# Altium schematic sheet 28PinArduino.SchDoc (part 1 of 3)
size A2
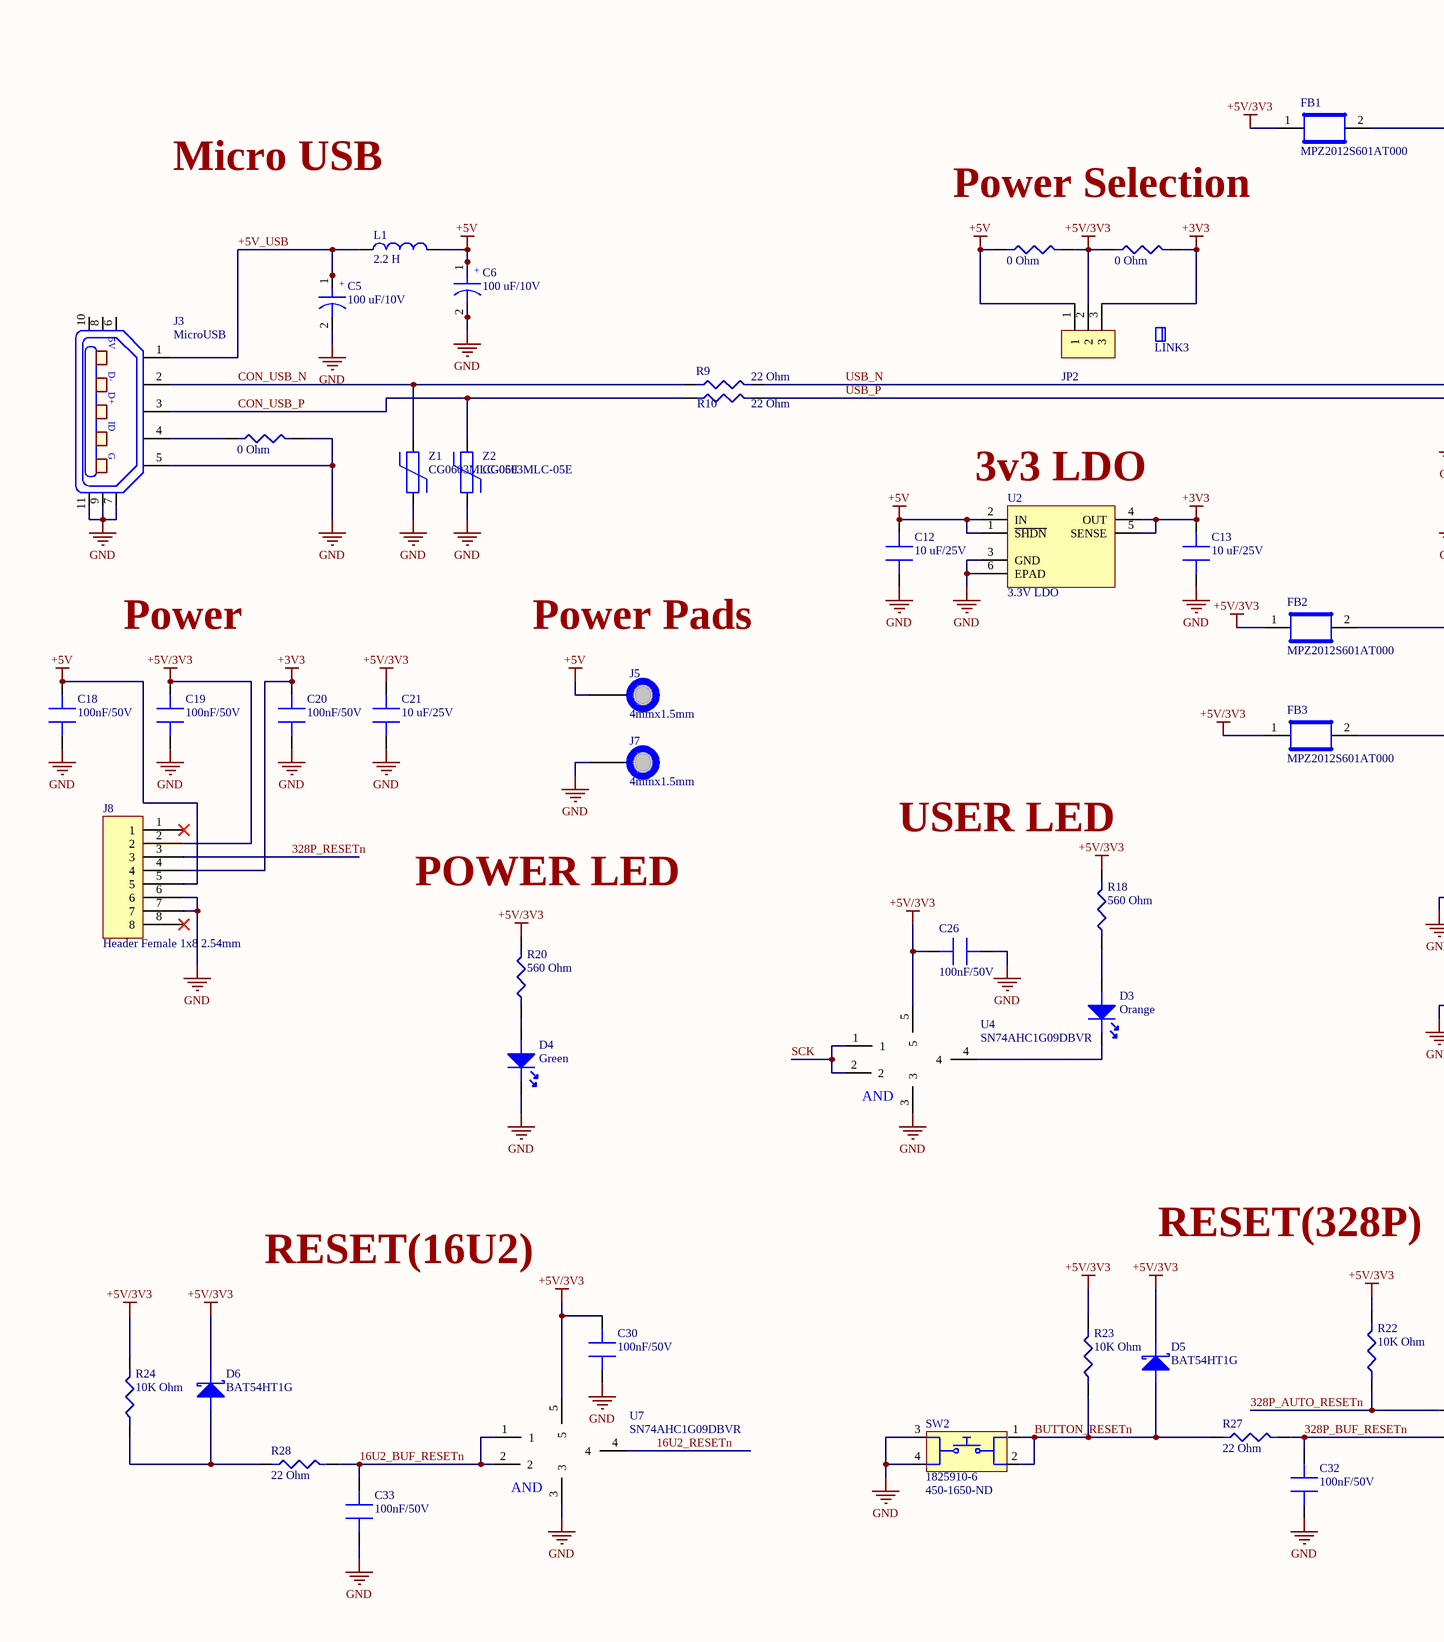
[diagram p0: 28PinArduino.SchDoc, left]
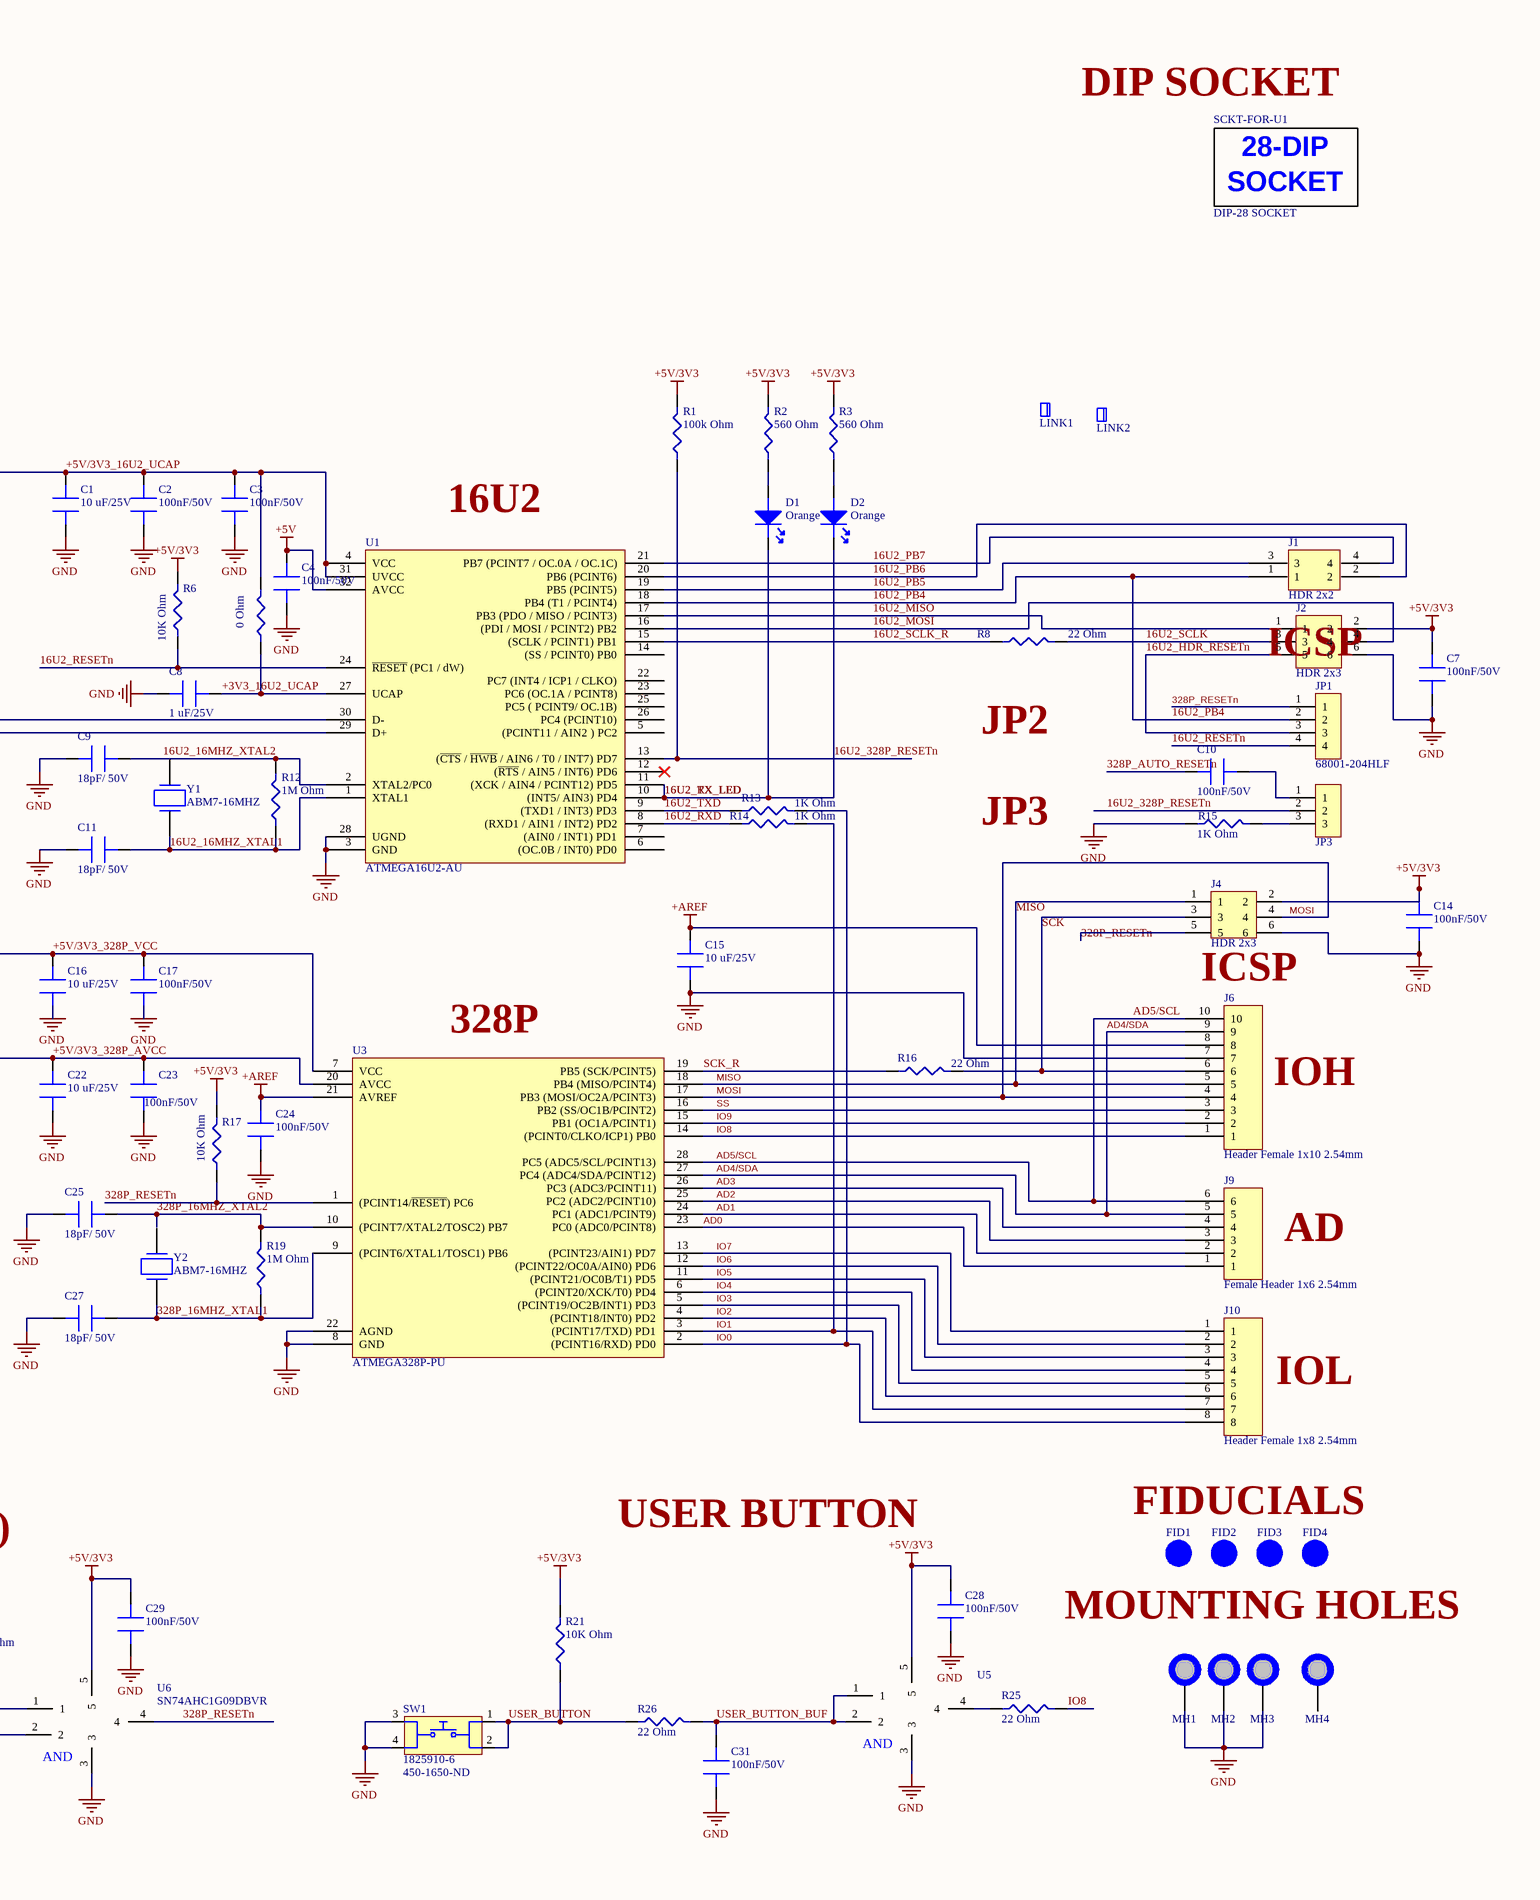
[diagram p1: 28PinArduino.SchDoc, right]

## Parts
C1  10 uF/25V  [CAPC2012X14N]
C2  100nF/50V  [CAPC2012X14N]
C3  100nF/50V  [CAPC2012X14N]
C4  100nF/50V  [CAPC2012X14N]
C5  100 uF/10V  [C_ALU_C_SIZE]
C6  100 uF/10V  [C_ALU_C_SIZE]
C7  100nF/50V  [CAPC2012X14N]
C8  1 uF/25V  [CAPC2012X14N]
C9  18pF/ 50V  [CAPC2012X14N]
C10  100nF/50V  [CAPC2012X14N]
C11  18pF/ 50V  [CAPC2012X14N]
C12  10 uF/25V  [CAPC2012X14N]
C13  10 uF/25V  [CAPC2012X14N]
C14  100nF/50V  [CAPC2012X14N]
C15  10 uF/25V  [CAPC2012X14N]
C16  10 uF/25V  [CAPC2012X14N]
C17  100nF/50V  [CAPC2012X14N]
C18  100nF/50V  [CAPC2012X14N]
C19  100nF/50V  [CAPC2012X14N]
C20  100nF/50V  [CAPC2012X14N]
C21  10 uF/25V  [CAPC2012X14N]
C22  10 uF/25V  [CAPC2012X14N]
C23  100nF/50V  [CAPC2012X14N]
C24  100nF/50V  [CAPC2012X14N]
C25  18pF/ 50V  [CAPC2012X14N]
C26  100nF/50V  [CAPC2012X14N]
C27  18pF/ 50V  [CAPC2012X14N]
C28  100nF/50V  [CAPC2012X14N]
C29  100nF/50V  [CAPC2012X14N]
C30  100nF/50V  [CAPC2012X14N]
C31  100nF/50V  [CAPC2012X14N]
C32  100nF/50V  [CAPC2012X14N]
C33  100nF/50V  [CAPC2012X14N]
D1  Orange  [LED0603]
D2  Orange  [LED0603]
D3  Orange  [LED0603]
D4  Green  [LED0603]
D5  BAT54HT1G  [Diode_SOD323]
D6  BAT54HT1G  [Diode_SOD323]
FB1  MPZ2012S601AT000  [CAPC2012X14N]
FB2  MPZ2012S601AT000  [CAPC2012X14N]
FB3  MPZ2012S601AT000  [CAPC2012X14N]
FID1  FID_1mm  [FID_40X1_20D]  (value not drawn)  (no BOM)
FID2  FID_1mm  [FID_40X1_20D]  (value not drawn)  (no BOM)
FID3  FID_1mm  [FID_40X1_20D]  (value not drawn)  (no BOM)
FID4  FID_1mm  [FID_40X1_20D]  (value not drawn)  (no BOM)
J1  HDR 2x2
J2  HDR 2x3  [DIP6]
J3  MicroUSB  [microUSB]
J4  HDR 2x3  [DIP6]
J5  4mmx1.5mm  [PAD_WITH_HOLE]  (no BOM)
J6  Header Female 1x10 2.54mm  [DIP20]
J7  4mmx1.5mm  [PAD_WITH_HOLE]  (no BOM)
J8  Header Female 1x8 2.54mm  [DIP16]
J9  Female Header 1x6 2.54mm  [DIP12]
J10  Header Female 1x8 2.54mm  [DIP16]
JP1  68001-204HLF  [DIP1x4]
JP2  68000-103HLF  [DIP1x3]  (value not drawn)
JP3  68000-103HLF  [DIP1x3]  (value not drawn)
L1  2.2 H  [L1210]
LINK1  Link  (value not drawn)  (mechanical)
LINK2  Link  (value not drawn)  (mechanical)
LINK3  Link  (value not drawn)  (mechanical)
MH1  MH_7.4MMC_3.2  [MH_7.4mm_3.2mm]  (value not drawn)  (no BOM)
MH2  MH_7.4MMC_3.2  [MH_7.4mm_3.2mm]  (value not drawn)  (no BOM)
MH3  MH_7.4MMC_3.2  [MH_7.4mm_3.2mm]  (value not drawn)  (no BOM)
MH4  MH_7.4MMC_3  [MH_7.4mm_3.2mm]  (value not drawn)  (no BOM)
R1  100k Ohm  [RESC2012X06N]
R2  560 Ohm  [RESC2012X06N]
R3  560 Ohm  [RESC2012X06N]
R4  0 Ohm
R5  0 Ohm
R6  10K Ohm  [RESC2012X06N]
R7  0 Ohm  [RESC2012X06N]
R8  22 Ohm  [RESC2012X06N]
R9  22 Ohm  [RESC2012X06N]
R10  22 Ohm  [RESC2012X06N]
R11  0 Ohm  [RESC2012X06N]
R12  1M Ohm  [RESC2012X06N]
R13  1K Ohm  [RESC2012X06N]
R14  1K Ohm  [RESC2012X06N]
R15  1K Ohm  [RESC2012X06N]
R16  22 Ohm  [RESC2012X06N]
R17  10K Ohm  [RESC2012X06N]
R18  560 Ohm  [RESC2012X06N]
R19  1M Ohm  [RESC2012X06N]
R20  560 Ohm  [RESC2012X06N]
R21  10K Ohm  [RESC2012X06N]
R22  10K Ohm  [RESC2012X06N]
R23  10K Ohm  [RESC2012X06N]
R24  10K Ohm  [RESC2012X06N]
R25  22 Ohm  [RESC2012X06N]
R26  22 Ohm  [RESC2012X06N]
R27  22 Ohm  [RESC2012X06N]
R28  22 Ohm  [RESC2012X06N]
SCKT-FOR-U1  DIP-28 SOCKET  [28_DIP_SOCKET]
SW1  1825910-6  Supplier Part Number 1: 450-1650-ND  [DIP4]
SW2  1825910-6  Supplier Part Number 1: 450-1650-ND  [DIP4]
U1  ATMEGA16U2-AU  [Quad32]
U2  3.3V LDO  [SOT223-6]
U3  ATMEGA328P-PU  [DIP28]
U4  SN74AHC1G09DBVR  [DBV_SOD235]
U5  SN74AHC1G09DBVR  [DBV_SOD235]  (value not drawn)
U6  SN74AHC1G09DBVR  [DBV_SOD235]
U7  SN74AHC1G09DBVR  [DBV_SOD235]
Y1  ABM7-16MHZ  [AGM7_v1_1_big]
Y2  ABM7-16MHZ  [AGM7_v1_1_big]
Z1  CG0603MLC-05E  [RESC1608X06N]
Z2  CG0603MLC-05E  [RESC1608X06N]

## Nets
+3V3: C13.2 C20.2 J8.4 JP2.3 R5.2 U2.4(OUT) U2.5(SENSE)
+5V: C4.2 C6.1 C12.2 C18.2 J5.1 J8.5 JP2.1 L1.2 R4.1 U1.32(AVCC) U2.1(~{SHDN}) U2.2(IN)
+5V/3V3: C7.2 C14.2 C19.2 C21.2 C26.1 C28.2 C29.2 C30.2 D5.1(Cathode) D6.1(Cathode) FB1.1 FB2.1 FB3.1 J2.2 J4.2 J8.2 JP2.2 R1.2 R2.2 R3.2 R4.2 R5.1 R6.2 R17.2 R18.2 R20.2 R21.2 R22.2 R23.2 R24.2 U4.5 U5.5 U6.5 U7.5
+AREF: C15.2 C24.2 J6.8 U3.21(AVREF)
GND: C1.1 C2.1 C3.1 C4.1 C5.2 C6.2 C7.1 C8.1 C9.1 C11.1 C12.1 C13.1 C14.1 C15.1 C16.1 C17.1 C18.1 C19.1 C20.1 C21.1 C22.1 C23.2 C24.1 C25.1 C26.2 C27.1 C28.1 C29.1 C30.1 C31.1 C32.1 C33.1 D4.1(Cathode) J2.6 J3.5 J3.7 J3.9 J3.11 J4.6 J6.7 J7.1 J8.6 J8.7 MH1.1 MH2.1 MH3.1 R11.2 R15.1 SW1.3 SW1.4 SW2.3 SW2.4 U1.3(GND) U1.28(UGND) U2.3(GND) U2.6(EPAD) U3.8(GND) U3.22(AGND) U4.3 U5.3 U6.3 U7.3 Z1.2 Z2.2
16U2_16MHZ_XTAL1: C11.2 R12.1 U1.1(XTAL1)
16U2_16MHZ_XTAL2: C9.2 R12.2 U1.2(XTAL2/PC0)
16U2_328P_RESETn: D1.1(Cathode) D2.1(Cathode) JP3.2 R1.1 U1.10((INT5/_AIN3)_PD4) U1.11((XCK_/_AIN4_/_PCINT12)_PD5) U1.13((~{CTS}_/_~{HWB}_/_AIN6_/_T0_/_INT7)_PD7)  [also labelled 16U2_RX_LED, 16U2_TX_LED]
16U2_BUF_RESETn: C33.2 R28.2 U7.1 U7.2
16U2_HDR_RESETn: J2.5 JP1.3
16U2_MISO: J2.1 U1.17(PB3_(PDO_/_MISO_/_PCINT3))
16U2_MOSI: J2.4 U1.16((PDI_/_MOSI_/_PCINT2)_PB2)
16U2_PB4: J1.1 JP1.2 U1.18(PB4_(T1_/_PCINT4))
16U2_PB5: J1.3 U1.19(PB5_(PCINT5))
16U2_PB6: J1.2 U1.20(PB6_(PCINT6))
16U2_PB7: J1.4 U1.21(PB7_(PCINT7_/_OC.0A_/_OC.1C))
16U2_RESETn: JP1.4 R6.1 U1.24(~{RESET}_(PC1_/_dW)) U7.4
16U2_RXD: R14.1 U1.8((RXD1_/_AIN1_/_INT2)_PD2)
16U2_SCLK: J2.3 R8.2
16U2_SCLK_R: R8.1 U1.15((SCLK_/_PCINT1)_PB1)
16U2_TXD: R13.1 U1.9((TXD1_/_INT3)_PD3)
328P_16MHZ_XTAL1: C27.2 R19.1 U3.9((PCINT6/XTAL1/TOSC1)_PB6)
328P_16MHZ_XTAL2: C25.2 R19.2 U3.10((PCINT7/XTAL2/TOSC2)_PB7)
328P_AUTO_RESETn: C10.1 R22.1 U6.1
328P_BUF_RESETn: C32.2 R27.2 U6.2
328P_RESETn: J4.5 J8.3 JP1.1 R17.1 U3.1((PCINT14/~{RESET})_PC6) U6.4
+3V3_16U2_UCAP: C8.2 R7.1 U1.27(UCAP)
+5V/3V3_16U2_UCAP: C1.2 C2.2 C3.2 FB1.2 R7.2 U1.4(VCC) U1.31(UVCC)
+5V/3V3_328P_AVCC: C22.2 C23.1 FB3.2 U3.20(AVCC)
+5V/3V3_328P_VCC: C16.2 C17.2 FB2.2 U3.7(VCC)
+5V_USB: C5.1 J3.1 L1.1
AD0: J9.1 U3.23(PC0_(ADC0/PCINT8))
AD1: J9.2 U3.24(PC1_(ADC1/PCINT9))
AD2: J9.3 U3.25(PC2_(ADC2/PCINT10))
AD3: J9.4 U3.26(PC3_(ADC3/PCINT11))
AD4/SDA: J6.9 J9.5 U3.27(PC4_(ADC4/SDA/PCINT12))
AD5/SCL: J6.10 J9.6 U3.28(PC5_(ADC5/SCL/PCINT13))
BUTTON_RESETn: D5.2(Anode) R23.1 R27.1 SW2.1 SW2.2
CON_USB_N: J3.2 R9.1 Z1.1
CON_USB_P: J3.3 R10.1 Z2.1
IO0: J10.8 R13.2 U3.2((PCINT16/RXD)_PD0)
IO1: J10.7 R14.2 U3.3((PCINT17/TXD)_PD1)
IO2: J10.6 U3.4((PCINT18/INT0)_PD2)
IO3: J10.5 U3.5((PCINT19/OC2B/INT1)_PD3)
IO4: J10.4 U3.6((PCINT20/XCK/T0)_PD4)
IO5: J10.3 U3.11((PCINT21/OC0B/T1)_PD5)
IO6: J10.2 U3.12((PCINT22/OC0A/AIN0)_PD6)
IO7: J10.1 U3.13((PCINT23/AIN1)_PD7)
IO8: J6.1 R25.2 U3.14((PCINT0/CLKO/ICP1)_PB0)
IO9: J6.2 U3.15(PB1_(OC1A/PCINT1))
MISO: J4.1 J6.5 U3.18(PB4_(MISO/PCINT4))
MOSI: J4.4 J6.4 U3.17(PB3_(MOSI/OC2A/PCINT3))
SCK: J4.3 J6.6 R16.2 U4.1 U4.2
SCK_R: R16.1 U3.19(PB5_(SCK/PCINT5))
SS: J6.3 U3.16(PB2_(SS/OC1B/PCINT2))
USB_N: R9.2 U1.30(D-)
USB_P: R10.2 U1.29(D+)
USER_BUTTON: R21.1 R26.1 SW1.1 SW1.2
USER_BUTTON_BUF: C31.2 R26.2 U5.1 U5.2
NetC10_2: C10.2 JP3.1
NetD1_2: D1.2(Anode) R2.1
NetD2_2: D2.2(Anode) R3.1
NetD3_1: D3.1(Cathode) U4.4
NetD3_2: D3.2(Anode) R18.1
NetD4_2: D4.2(Anode) R20.1
NetD6_2: D6.2(Anode) R24.1 R28.1
NetJ3_4: J3.4 R11.1
NetJP3_3: JP3.3 R15.2
NetR25_1: R25.1 U5.4

Not connected (* = marked no-connect by the designer): J3 6 8 10; J8 1* 8*; MH4 1; U1 5((PCINT11_/_AIN2_)_PC2) 6((OC.0B_/_INT0)_PD0) 7((AIN0_/_INT1)_PD1) 12((~{RTS}_/_AIN5_/_INT6)_PD6)* 14((SS_/_PCINT0)_PB0) 22(PC7_(INT4_/_ICP1_/_CLKO)) 23(PC6_(OC.1A_/_PCINT8)) 25(PC5_(_PCINT9/_OC.1B)) 26(PC4_(PCINT10)); Y1 1 2; Y2 1 2

## Notes on the sheet
- DIP SOCKET
- Micro USB
- Power Selection
- (near U1) 16U2
- (near J2) ICSP
- JP2
- (near U2) 3v3 LDO
- JP3
- Power
- Power Pads
- (near J4) ICSP
- (near U3) 328P
- IOH
- (near R18) USER LED
- POWER LED
- AD
- IOL
- RESET(328P)
- USER BUTTON
- FIDUCIALS
- RESET(16U2)
- MOUNTING HOLES
- (in symbol 10118193-0001LF) 5V; D-; D+; ID; G
- (in symbol 7010501790) 28-DIP; SOCKET
- (in symbol EEE-1AA101WR) +
- (in symbol SN74AHC1G09DBVR) AND